# EAGLE schematic bk-circ1-S (EAGLE 9.1.0)
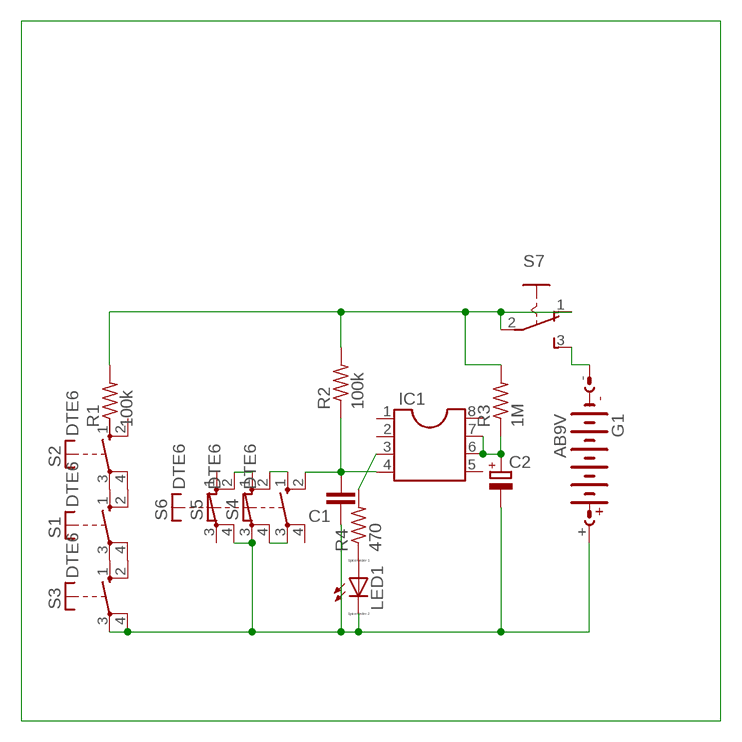
[diagram p0: schematic, sheet 1]

## Parts
C1  C-EU025-030X050  [C025-030X050]
C2  CPOL-EUB45181B  [B45181B]
G1  AB9V  [AB9V]
IC1  DIL8  [DIL08]
LED1  LED_ELD260  [LED_LD260]
R1  100k  R-US_0207/7  [0207/7]
R2  100k  R-US_0207/7  [0207/7]
R3  1M  R-US_0207/7  [0207/7]
R4  470  R-US_0207/7  [0207/7]
S1  DTE6  [DTE6]
S2  DTE6  [DTE6]
S3  DTE6  [DTE6]
S4  DTE6  [DTE6]
S5  DTE6  [DTE6]
S6  DTE6  [DTE6]
S7  255SB  [255SB]

## Nets
N$1: C2.+ IC1.6 IC1.7 R3.1
N$2: C1.2 IC1.4 R2.1 S4.2(S)
N$3: LED1.A R4.1
N$4: G1.- S7.3(S)
N$5: R1.2 R2.2 R3.2 S7.1(O) S7.2(P)
N$6: S4.1(S) S5.2(S)
N$7: S5.1(S) S6.2(S)
N$8: C1.1 C2.- G1.+ LED1.K(C) S3.3(P) S3.4(P) S5.3(P) S6.4(P)
N$9: S4.3(P) S5.4(P)
N$10: S1.3(P) S3.1(S)
N$11: S1.4(P) S3.2(S)
N$12: S1.1(S) S2.3(P)
N$13: S1.2(S) S2.4(P)
N$14: IC1.3 R4.2
Unconnected: IC1.1 IC1.2 IC1.5 IC1.8 R1.1 S2.1(S) S2.2(S) S4.4(P) S6.1(S) S6.3(P)

## Library data of the parts
C1 = resistor:C-EU: CAPACITOR, European symbol
C2 = resistor:CPOL-EU: POLARIZED CAPACITOR, European symbol
G1 = battery:AB9V: 9-V BATTERY CLIP
IC1 = ic-package:DIL8: Dual In Line / Socket
LED1 = eagle-ltspice:LED_E: LED Source: http://www.osram.convergy.de Source: www.luxeon.com Source: www.kingbright.com; SPICEMODEL: NONE; SPICEPREFIX: D; SPICETYPE: diode
R1-R4 = resistor:R-US_: RESISTOR, American symbol
S1-S6 = switch-misc:DT: ITT SWITCH
S7 = switch:255SB: SLIDING SWITCH Distributor Buerklin, 11G810